# EAGLE design TubeScreamer (EAGLE 7.2.0)
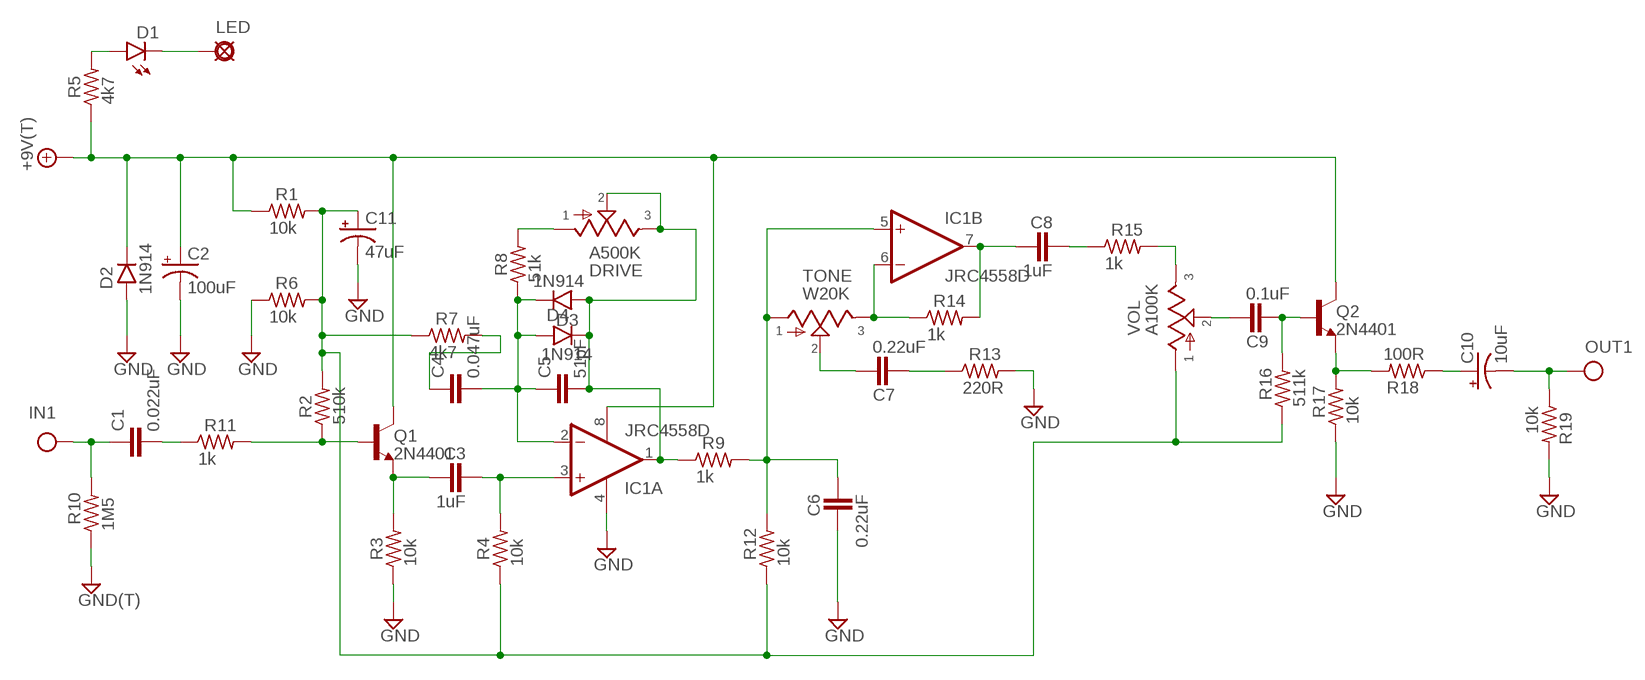
[diagram p0: schematic, sheet 1]

## Parts
+9V1  +9V(T)  [SQUARE]
C1  0.022uF  070X0302  [070X030]
C2  100uF  080  [080_035]
C3  1uF  072X0352  [072X035]
C4  0.047uF  070X0302  [070X030]
C5  51pF  050X030_0251  [050X030_025]
C6  0.22uF  072X0352  [072X035]
C7  0.22uF  072X0352  [072X035]
C8  1uF  072X0352  [072X035]
C9  0.1uF  072X0352  [072X035]
C10  10uF  0631  [063_025]
C11  47uF  0631  [063_025]
D1  LED3MM  [LED3MM]
D2  1N914  1N914.3  [DO35-3]
D3  1N914  1N914.3  [DO35-3]
D4  1N914  1N914.3  [DO35-3]
DRIVE  A500K  POT16MM  [16MM]
GND1  GND(T)  [SQUARE]
IC1  JRC4558D  LM4558N  [DIL08]
IN1  IN(T)  [SQUARE]
LED  3mm  PAD  [SQUARE]
OUT1  OUT(T)  [SQUARE]
Q1  2N4401  2N3904  [TO92-]
Q2  2N4401  2N3904  [TO92-]
R1  10k  6MM.3  [R0207/3]
R2  510k  6MM.3  [R0207/3]
R3  10k  6MM.3  [R0207/3]
R4  10k  6MM.3  [R0207/3]
R5  4k7  6MM.3  [R0207/3]
R6  10k  6MM.3  [R0207/3]
R7  4k7  6MM.3  [R0207/3]
R8  51k  6MM.3  [R0207/3]
R9  1k  6MM.3  [R0207/3]
R10  1M5  6MM.3  [R0207/3]
R11  1k  6MM.3  [R0207/3]
R12  10k  6MM.3  [R0207/3]
R13  220R  6MM.3  [R0207/3]
R14  1k  6MM.3  [R0207/3]
R15  1k  6MM.3  [R0207/3]
R16  511k  6MM.3  [R0207/3]
R17  10k  6MM.3  [R0207/3]
R18  100R  6MM.3  [R0207/3]
R19  10k  6MM.3  [R0207/3]
TONE  W20K  POT16MM  [16MM]
VOL  A100K  POT16MM  [16MM]

## Nets
+9V: +9V1.1(+9V) C2.+ D2.C IC1.8(P:V+) Q1.1(C) Q2.1(C) R1.1 R5.1
GND: C2.- C6.1 C11.- D2.A GND1.1(GND) IC1.4(P:V-) R3.1 R6.1 R10.1 R13.2 R17.1 R19.2
IN: C1.1 IN1.1(IN) R10.2
N$1: C1.2 R11.1
N$2: Q1.2(B) R2.1 R11.2
N$3: D1.A R5.2
N$4: C3.1 Q1.3(E) R3.2
N$5: C11.+ R1.2 R2.2 R4.1 R6.2 R7.1 R12.1 R16.1 VOL.1
N$6: C3.2 IC1.3(A:+IN) R4.2
N$7: C5.2 D3.A D4.C DRIVE.2 DRIVE.3 IC1.1(A:OUT) R9.1
N$8: C4.1 R7.2
N$9: DRIVE.1 R8.2
N$10: C4.2 C5.1 D3.C D4.A IC1.2(A:-IN) R8.1
N$11: C7.2 TONE.2
N$12: C6.2 IC1.5(B:+IN) R9.2 R12.2 TONE.1
N$13: C7.1 R13.1
N$14: IC1.6(B:-IN) R14.1 TONE.3
N$15: C8.1 IC1.7(B:OUT) R14.2
N$16: C8.2 R15.1
N$17: R15.2 VOL.3
N$18: C9.2 VOL.2
N$19: C9.1 Q2.2(B) R16.2
N$20: Q2.3(E) R17.2 R18.2
N$21: C10.+ R18.1
N$22: D1.K(C) LED.1(PAD)
OUT: C10.- OUT1.1(OUT) R19.1

## Library data of the parts
+9V1 = mb_supply:+9V(T): +9V Voltage Supply use this to hook up +9v throughout a schematic instead of running wire automatically labels the net "+9v" adds a hookup pad to the circuit board
C1 C4 = mb_caps-chicklet:070X030: 0.0001 - .01uF (100 - 10,000pF) Panasonic ECQ-B 7mm x 3mm 50 or 63V: 0.0001 - .01uF (100 - 10,000pF);
C2 = mb_caps-electro:080: 47 - 470uF Xicon values at Mouser.com 10V: 330, 470uF; 16V: 220, 330uF; 25V: 220uF; 50V: 47, 100uF
C3 C6-C9 = mb_caps-box:072X035: 0.15 - 1.0uF; WIMA MKP2 63, 100V: 0.047uF; MKS2 50V: 0.68 - 1.0uF; 63V: 0.33 - 0.47uF; 100V: 0.15 - 0.22uF;
C5 = mb_caps-ceramic:050X030_025: 47 - 120pF Xicon Ceramic Disc 2.5mm lead spacing
C10 C11 = mb_caps-electro:063: 33 - 220uF Xicon values at Mouser.com 10V: 220uF; 16V: 100uF; 25V: 100uF; 50V: 33uF
D1 = mb_diodes:LED
D2-D4 = mb_diodes:1N914: Fast Switching Diode DO-35 glass case a.k.a. 1N4148
DRIVE TONE VOL = mb_pots:POT: Potentiometers the arrow indicates the clockwise motion of th wiper (lug 2) fully counter clockwise there is no resistance between lugs 1 and 2 fully clockwise the resistance between lugs 1 and 2 is the value of the pot
GND1 = mb_supply:GND(T): Ground use this to hook up ground (GND) throughout a schematic instead of running wire automatically labels the net "GND" adds a hookup pad to the circuit board (you can use several)
IC1 = mb_ics:*4558: *4558 Op Amp Infamous for its use in tube screamers. This op amp has many manufacturers, hence the leading "*" in the name. The JRC4558 is a widely used example.
IN1 = mb_supply:IN(T): Input obsolete: use Pad instead and label net shematic input label with circuit board terminal/pad generally used only once on a schematic (because this device labels the net "IN" in the same way as a voltage supply or ground net)
LED = mb_supply:PAD: PAD use this package for pads with any purpose, including input, output, send or return various pad shapes: round, square, octogonal, long, and long offset
OUT1 = mb_supply:OUT(T): Output obsolete: use Pad instead and label net output label with circuit board terminal/pad usually appears only once on a schematic
Q1 Q2 = mb_trans:2N3904: NPN Transistor
R1-R19 = mb_resistors:6MM: 6mm Resistors Leads spaced 1-6 holes apart for 0.1" perfboard. Suitable for 1/4 watt resistors.

## Board
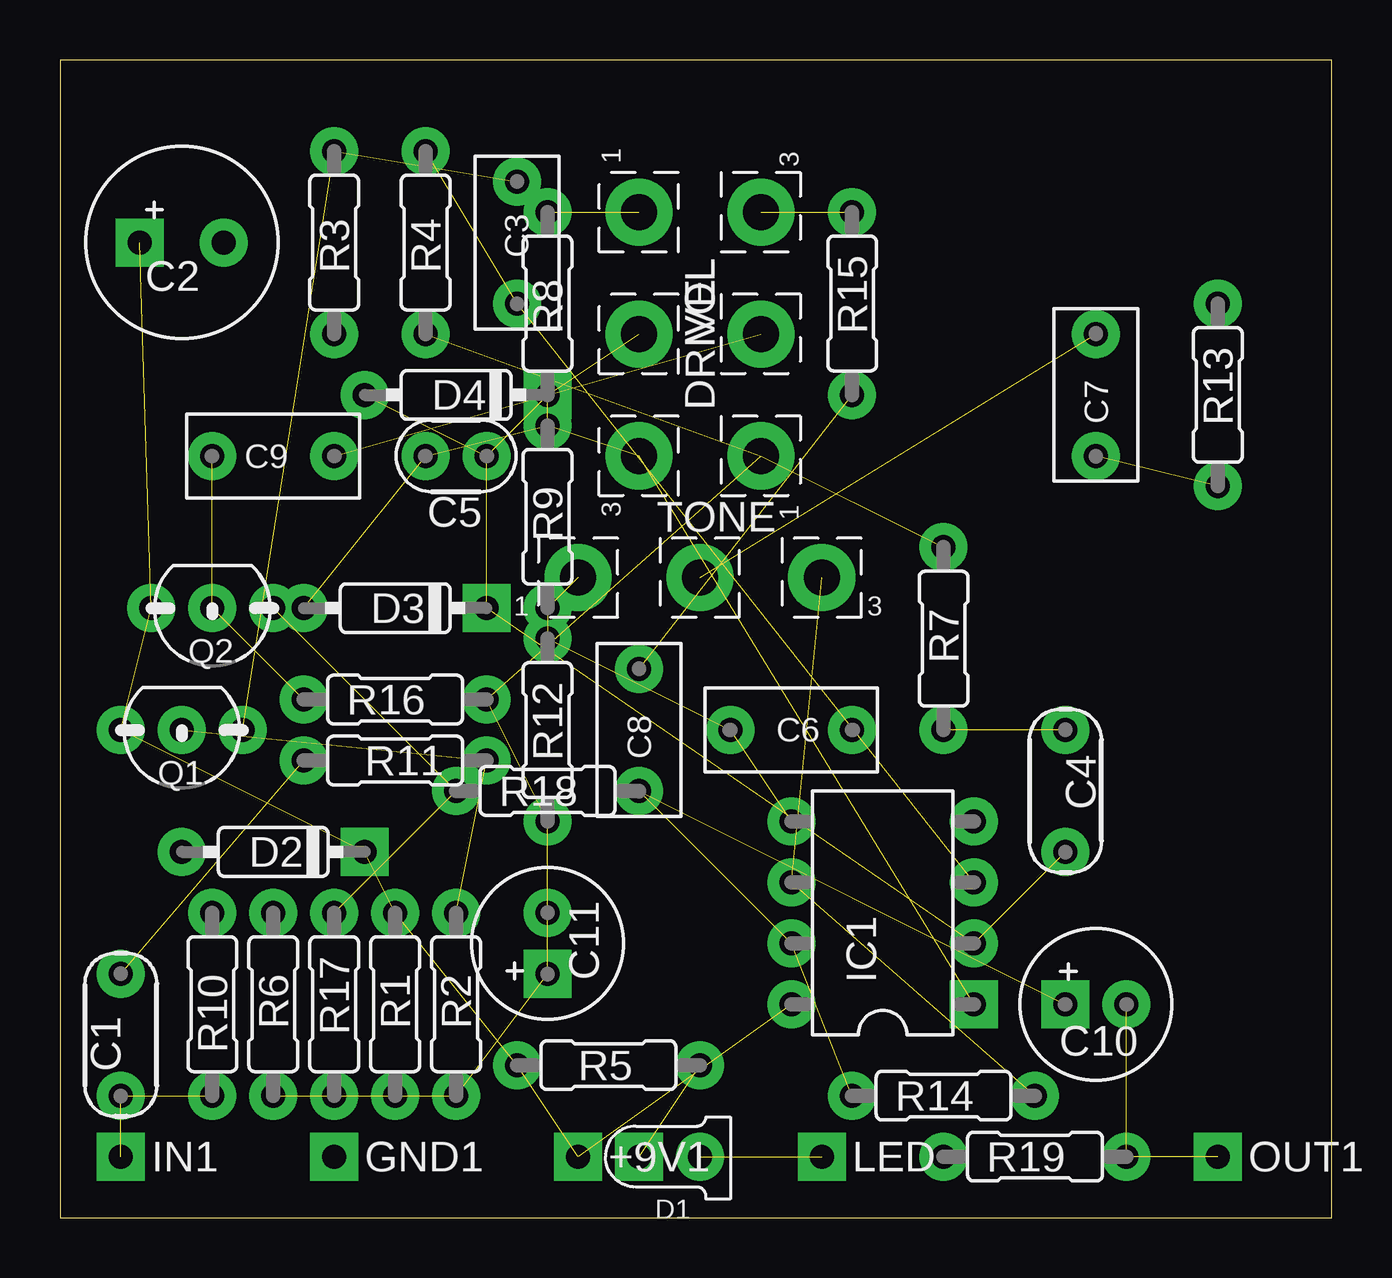
[diagram p1: board, top side]
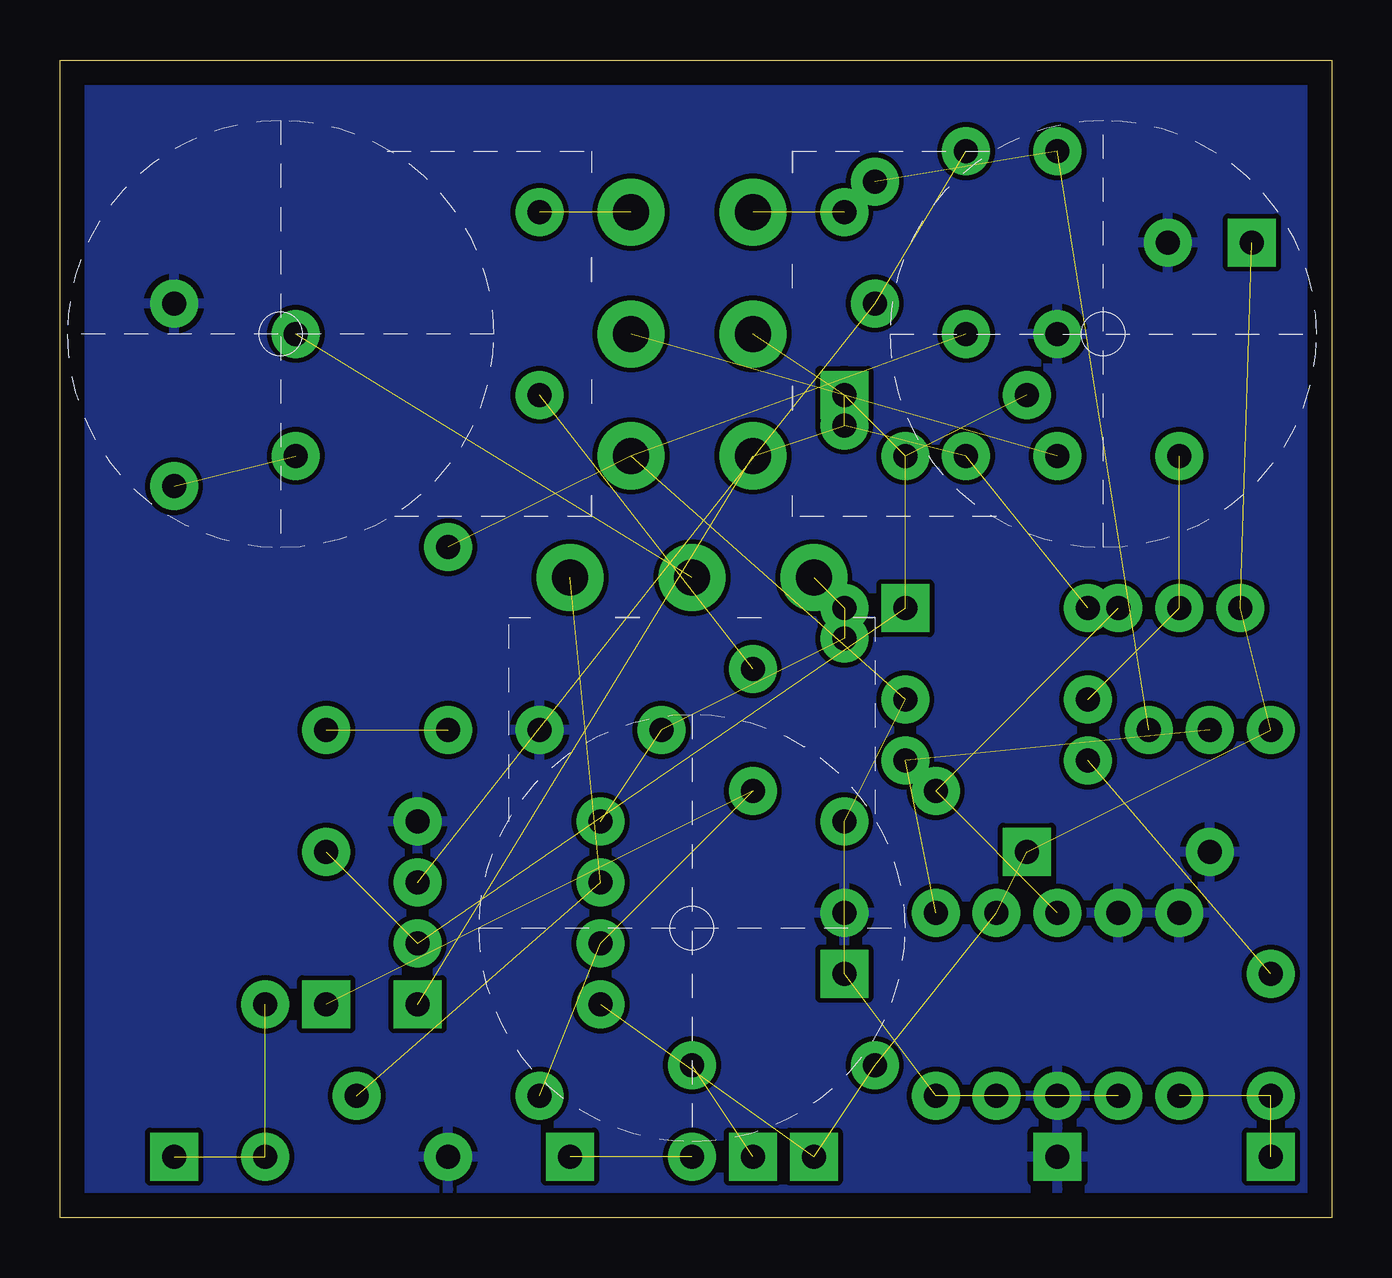
[diagram p2: board, bottom side, seen from below]

Size 53.01 x 48.25 mm. Coordinates in mm from the lower left corner, seen from the top.
Outline: 0,0 53.01,0 53.01,48.25 0,48.25 0,0
Copper layers (1*16): Top 0.035mm / dielectric 1.5mm / Bottom 0.035mm
Design rules "default": minimum track width 10mil, minimum drill 24mil, track to track 8mil, track to pad 8mil, pad to pad 8mil, via to via 8mil, smd to smd 8mil, copper to edge 40mil, drill to drill 8mil, minimum pad ring 10mil, minimum via ring 8mil, stop-mask expansion 4mil, vias tented up to drill 0mil, thermal gap 10mil

### Footprints (pad centres in the part's own frame; a part is rotated, then mirrored left to right if it is on the bottom)
SQUARE = drill 1 pad 2 square: 1 0,0
070X030 = drill 1 pad 2: 1 -2.54,0; 2 2.54,0
080_035 = drill 1 pad 2 square: + -1.75,0 | drill 1 pad 2: - 1.75,0
072X035 = drill 1 pad 2: 1 -2.54,0; 2 2.54,0
050X030_025 = drill 1 pad 2: 1 -1.27,0; 2 1.27,0
063_025 = drill 1 pad 2 square: + -1.27,0 | drill 1 pad 2: - 1.27,0
LED3MM = drill 1 pad 2 square: A -1.27,0 | drill 1 pad 2: K 1.27,0
DO35-3 = drill 1 pad 2: A 3.81,0 | drill 1 pad 2 square: C -3.81,0
16MM = drill 1.5 pad 2.794: 1 5.08,0; 2 0,0; 3 -5.08,0
DIL08 = drill 1 pad 2 square: 1 -3.81,-3.81 | drill 1 pad 2: 2 -1.27,-3.81; 3 1.27,-3.81; 4 3.81,-3.81; 5 3.81,3.81; 6 1.27,3.81; 7 -1.27,3.81; 8 -3.81,3.81
TO92- = drill 1 pad 2: 1 2.54,0; 2 0,0; 3 -2.54,0
R0207/3 = drill 1 pad 2: 1 -3.81,0; 2 3.81,0

### Placement (x,y rotation side)
+9V1  21.59,2.54 0 top
C1  2.54,7.62 90 top
C2  5.08,40.64 0 top
C3  19.05,40.64 270 top
C4  41.91,17.78 270 top
C5  16.51,31.75 180 top
C6  30.48,20.32 180 top
C7  43.18,34.29 90 top
C8  24.13,20.32 90 top
C9  8.89,31.75 0 top
C10  43.18,8.89 0 top
C11  20.32,11.43 90 top
D1  25.4,2.54 0 top
D2  8.89,15.24 180 top
D3  13.97,25.4 180 top
D4  16.51,34.29 180 top
DRIVE  24.13,36.83 90 top
GND1  11.43,2.54 0 top
IC1  34.29,12.7 90 top
IN1  2.54,2.54 0 top
LED  31.75,2.54 0 top
OUT1  48.26,2.54 0 top
Q1  5.08,20.32 180 top
Q2  6.35,25.4 180 top
R1  13.97,8.89 270 top
R2  16.51,8.89 270 top
R3  11.43,40.64 90 top
R4  15.24,40.64 90 top
R5  22.86,6.35 0 top
R6  8.89,8.89 270 top
R7  36.83,24.13 270 top
R8  20.32,38.1 90 top
R9  20.32,29.21 270 top
R10  6.35,8.89 270 top
R11  13.97,19.05 0 top
R12  20.32,20.32 90 top
R13  48.26,34.29 90 top
R14  36.83,5.08 180 top
R15  33.02,38.1 90 top
R16  13.97,21.59 180 top
R17  11.43,8.89 90 top
R18  20.32,17.78 180 top
R19  40.64,2.54 180 top
TONE  26.67,26.67 180 top
VOL  29.21,36.83 270 top

### Tracks (layer width: path | path; a pad name or v marks a point on that pad's centre or on a via)
+9V  (7 unrouted)
GND
  pour Bottom: 0,0 0,48.26 53.34,48.26 53.34,0
IN  (2 unrouted)
N$1  (1 unrouted)
N$2  (2 unrouted)
N$3  (1 unrouted)
N$4  (2 unrouted)
N$5  (8 unrouted)
N$6  (2 unrouted)
N$7  (6 unrouted)
N$8  (1 unrouted)
N$9  (1 unrouted)
N$10  (5 unrouted)
N$11  (1 unrouted)
N$12  (4 unrouted)
N$13  (1 unrouted)
N$14  (2 unrouted)
N$15  (2 unrouted)
N$16  (1 unrouted)
N$17  (1 unrouted)
N$18  (1 unrouted)
N$19  (2 unrouted)
N$20  (2 unrouted)
N$21  (1 unrouted)
N$22  (1 unrouted)
OUT  (2 unrouted)